# EAGLE schematic xbee adapter (EAGLE 6.2)
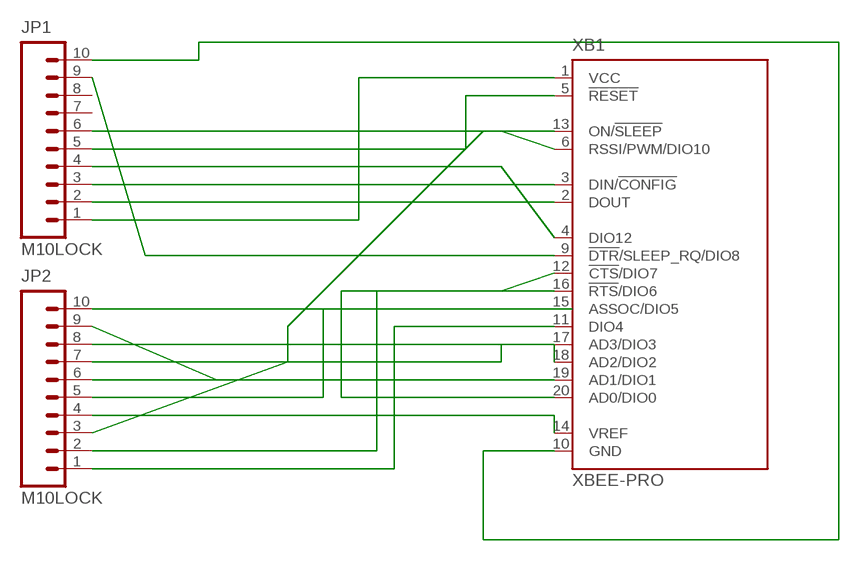
[diagram p0: schematic, sheet 1]

## Parts
JP1  M10LOCK  [1X10_LOCK]
JP2  M10LOCK  [1X10_LOCK]
XB1  XBEE-PRO  [XBEE-PRO]

## Nets
N$1: JP1.1 XB1.1(VCC)
N$2: JP1.2 XB1.2(DOUT)
N$3: JP1.3 XB1.3(DIN/!CONFIG)
N$4: JP1.4 XB1.4(DIO12)
N$5: JP1.5 XB1.5(!RESET)
N$6: JP1.6 XB1.6(RSSI/PWM/DIO10)
N$7: JP1.9 XB1.9(!DTR!/SLEEP_RQ/DIO8)
N$8: JP1.10 XB1.10(GND)
N$9: JP2.1 XB1.11(DIO4)
N$10: JP2.2 XB1.12(!CTS!/DIO7)
N$11: JP2.3 XB1.13(ON/!SLEEP)
N$12: JP2.4 XB1.14(VREF)
N$13: JP2.5
N$14: JP2.6 XB1.16(!RTS!/DIO6)
N$15: JP2.7 XB1.17(AD3/DIO3)
N$16: JP2.8 XB1.18(AD2/DIO2)
N$17: JP2.9 XB1.19(AD1/DIO1)
N$18: JP2.10 XB1.20(AD0/DIO0)
Unconnected: JP1.7 JP1.8 XB1.15(ASSOC/DIO5)

## Library data of the parts
JP1 JP2 = SparkFun-Connectors:M10: Header 10 Standard 10-pin 0.1" header. Use with straight break away headers (SKU : PRT-00116), right angle break away headers (PRT-00553), swiss pins (PRT-00743), machine pins (PRT-00117), and female headers (PRT-00115).
XB1 = xbee:XBEE: XBee (TM) /XBee-PRO(TM) OEM RF Modules Source: MaxStream, Inc. xbee_productmanual.pdf; MPN: XBP24-AWI-001; OC_FARNELL: 1337916; OC_NEWARK: 42M2667